# EAGLE design Nixie mainboard v1.0 (EAGLE 7.5.0)
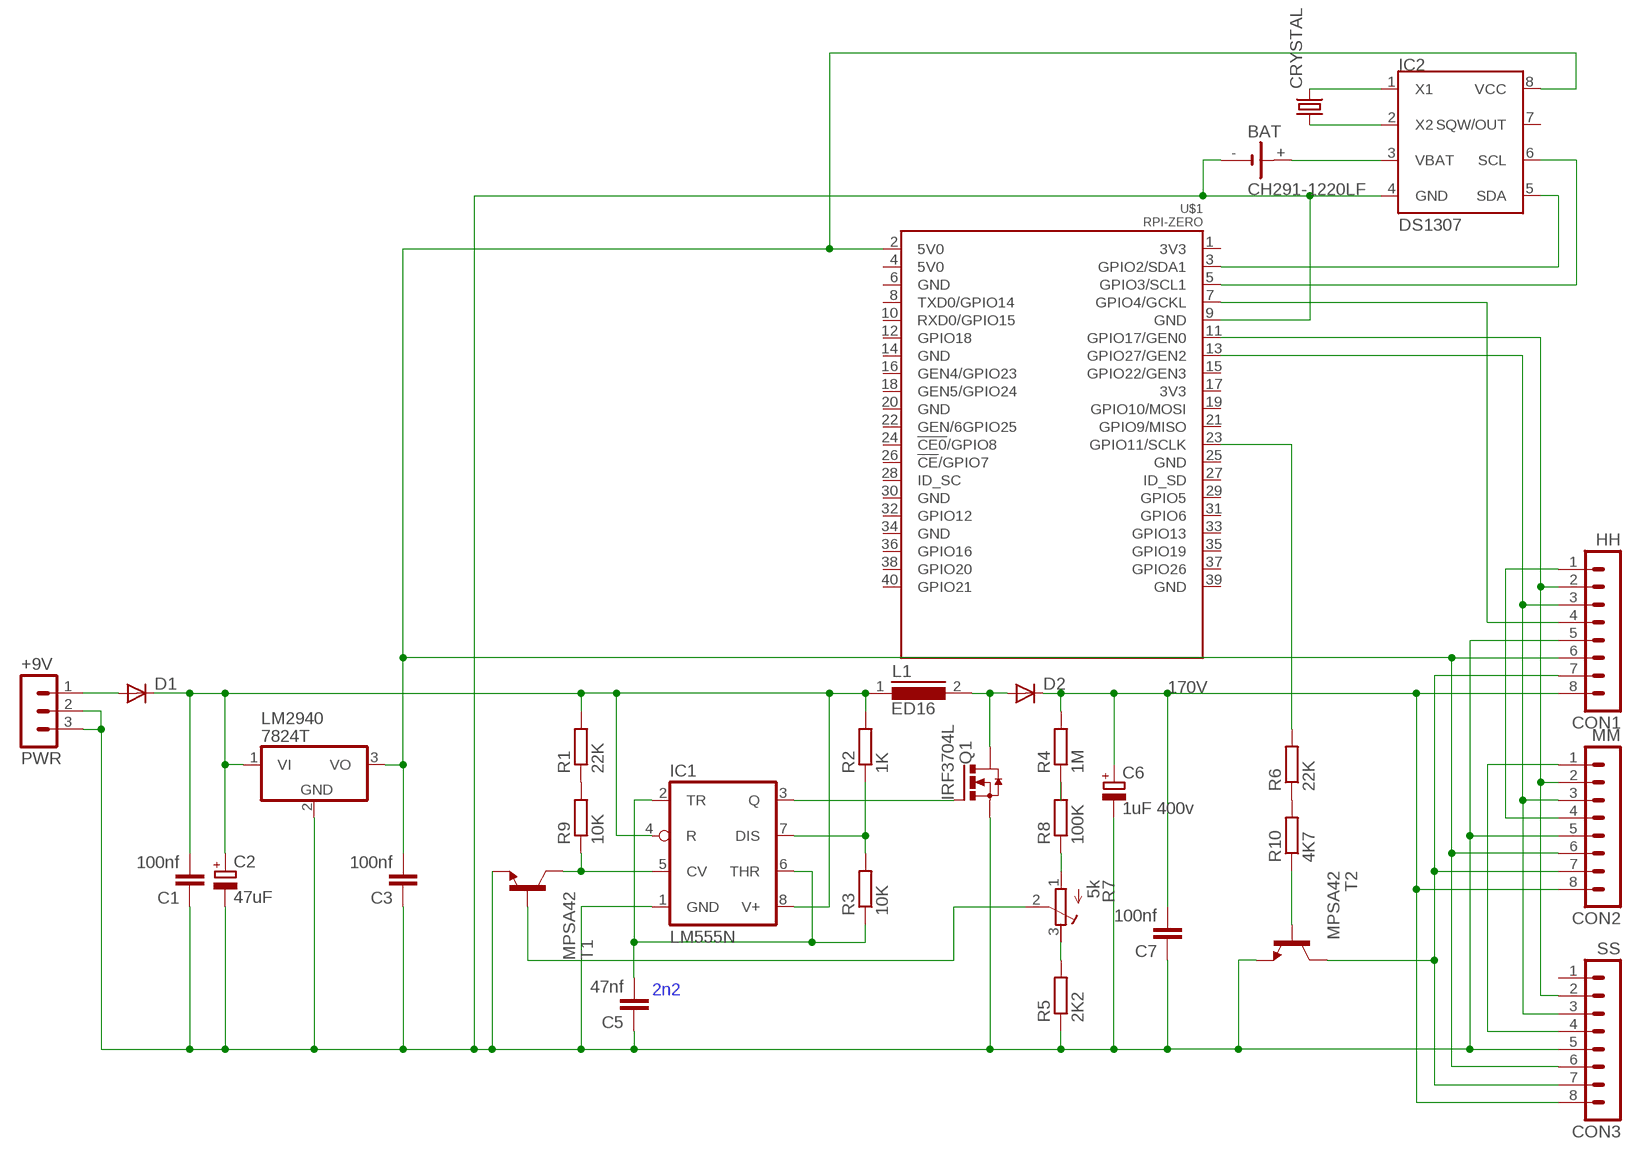
[diagram p0: schematic, sheet 1]

## Parts
BAT  CH291-1220LF  [CH291-1220LF]
C1  100nf  C-EU025-025X050  [C025-025X050]
C2  47uF  CPOL-EUE5-8.5  [E5-8,5]
C3  100nf  C-EU025-025X050  [C025-025X050]
C5  47nf  C-EU075-032X103  [C075-032X103]
C6  1uF 400v  CPOL-EUE2.5-6  [E2,5-6]
C7  100nf  C-EU075-032X103  [C075-032X103]
CON1  HH  MA08-1  [MA08-1]
CON2  MM  MA08-1  [MA08-1]
CON3  SS  MA08-1  [MA08-1]
CRYSTAL  CRYSTALTC26V  [TC26V]
D1  DIODE-DO41-10  [DO41-10]
D2  1N4936  1N4933  [DO41-10]
IC1  LM555N  [DIL08]
IC2  DS1307  [SOIC-8]
L1  ED16  [ED16]
LM2940  7824T  [TO220H]
PWR  +9V  MA03-1  [MA03-1]
Q1  IRF3704L  [TO262-H]
R1  22K  R-EU_0207/10  [0207/10]
R2  1K  R-EU_0207/10  [0207/10]
R3  10K  R-EU_0207/10  [0207/10]
R4  1M  R-EU_0207/10  [0207/10]
R5  2K2  R-EU_0207/10  [0207/10]
R6  22K  R-EU_0207/10  [0207/10]
R7  5k  R-TRIMM64W  [RTRIM64W]
R8  100K  R-EU_0207/10  [0207/10]
R9  10K  R-EU_0207/10  [0207/10]
R10  4K7  R-EU_0207/10  [0207/10]
T1  MPSA42  MPSA42-NPN-TO92-EBC  [TO92-EBC]
T2  MPSA42  MPSL51-NPN-TO92-CBE  [TO92-CBE]
U$1  RPI-ZERO  [RASPBERRYPI_BASTELSTUBE_V13_RASPI_BOARD_B+_FULL]

## Nets
5V0: C3.2 CON1.6 CON2.6 CON3.6 IC2.8(VCC) LM2940.3(VO) U$1.2(5V0)
170V: C6.+ C7.2 CON1.8 CON2.8 CON3.8 D2.C R4.2
CLK: CON1.2 CON2.2 CON3.2 U$1.11(GPIO17/GEN0)
DATA: CON1.4 U$1.7(GPIO4/GCKL)
GND@1: BAT.- C1.1 C2.- C3.1 C5.1 C6.- C7.1 CON1.5 CON2.5 CON3.5 IC1.1(GND) IC2.4(GND) LM2940.2(GND) PWR.2 PWR.3 Q1.3(S) R5.1 T1.E T2.E U$1.9(GND)
LATCH: CON1.3 CON2.3 CON3.3 U$1.13(GPIO27/GEN2)
LED: CON1.7 CON2.7 CON3.7 T2.C
LEDDRIVER: R6.2 U$1.23(GPIO11/SCLK)
N$1: CON1.1 CON2.4
N$2: CON2.1 CON3.4
N$4: BAT.+ IC2.3(VBAT)
N$6: R4.1 R8.2
N$7: R7.1(A) R8.1
N$8: R1.1 R9.2
N$9: R10.1 T2.B
N$11: IC2.6(SCL) U$1.5(GPIO3/SCL1)
N$12: IC2.5(SDA) U$1.3(GPIO2/SDA1)
N$13: R6.1 R10.2
N$14: CRYSTAL.1 IC2.2(X2)
N$15: CRYSTAL.2 IC2.1(X1)
N$95: D1.A PWR.1
N$99: IC1.3(Q) Q1.1(G)
N$100: IC1.7(DIS) R2.1 R3.2
N$101: IC1.5(CV) R9.1 T1.C
N$102: C5.2 IC1.2(TR) IC1.6(THR) R3.1
N$103: D2.A L1.2 Q1.2(D)
N$106: R7.2(S) T1.B
N$107: R5.2 R7.3(E)
V+: C1.2 C2.+ D1.C IC1.4(R) IC1.8(V+) L1.1 LM2940.1(VI) R1.2 R2.2
Unconnected: CON3.1 IC2.7(SQW/OUT) U$1.1(3V3) U$1.4(5V0) U$1.6(GND) U$1.8(TXD0/GPIO14) U$1.10(RXD0/GPIO15) U$1.12(GPIO18) U$1.14(GND) U$1.15(GPIO22/GEN3) U$1.16(GEN4/GPIO23) U$1.17(3V3) U$1.18(GEN5/GPIO24) U$1.19(GPIO10/MOSI) U$1.20(GND) U$1.21(GPIO9/MISO) U$1.22(GEN/6GPIO25) U$1.24(!CE0!/GPIO8) U$1.25(GND) U$1.26(!CE!/GPIO7) U$1.27(ID_SD) U$1.28(ID_SC) U$1.29(GPIO5) U$1.30(GND) U$1.31(GPIO6) U$1.32(GPIO12) U$1.33(GPIO13) U$1.34(GND) U$1.35(GPIO19) U$1.36(GPIO16) U$1.37(GPIO26) U$1.38(GPIO20) U$1.39(GND) U$1.40(GPIO21)

## Notes on the sheet
- 2n2

## Library data of the parts
BAT = battery:CH291-1220LF: Battery Holder, SMT, 12mm multicomp PART NO. CH291-1220LF Source: Data sheet <http://www.farnell.com/datasheets/1505860.pdf>
C1 C3 C5 C7 = rcl:C-EU: CAPACITOR, European symbol
C2 C6 = rcl:CPOL-EU: POLARIZED CAPACITOR, European symbol
CON1-CON3 = con-lstb:MA08-1: PIN HEADER; OC_FARNELL: unknown; OC_NEWARK: unknown
CRYSTAL = crystal:CRYSTAL: CRYSTAL; OC_FARNELL: unknown; OC_NEWARK: unknown
D1 = diode:DIODE-: DIODE
D2 = diode:1N4933: DIODE fast recovery rectifier, 1A
IC1 = linear:*555: TIMER
IC2 = dallas-1:DS1307: I2C Serial RTC w/56 bytes battery backed RAM
L1 = inductors:ED16: INDUCTOR
LM2940 = linear:78*: Positive VOLTAGE REGULATOR Source: http://cache.national.com/ds/LM/LM78L05.pdf http://www.fairchildsemi.com/ds/LM/LM7805.pdf
PWR = con-lstb:MA03-1: PIN HEADER; OC_FARNELL: unknown; OC_NEWARK: unknown
Q1 = transistor-power:IRF3704: SMPS MOSFET HEXFET® Power MOSFET Source: http://www.irf.com/product-info/datasheets/data/irf3704.pdf
R1-R6 R8-R10 = resistor:R-EU_: RESISTOR, European symbol
R7 = rcl:R-TRIMM: Trimm resistor
T1 T2 = transistor:*-NPN-: NPN Transistror BF959 corrected 2008.03.06
U$1 = RPI-Zero:RPI-ZERO

## Board
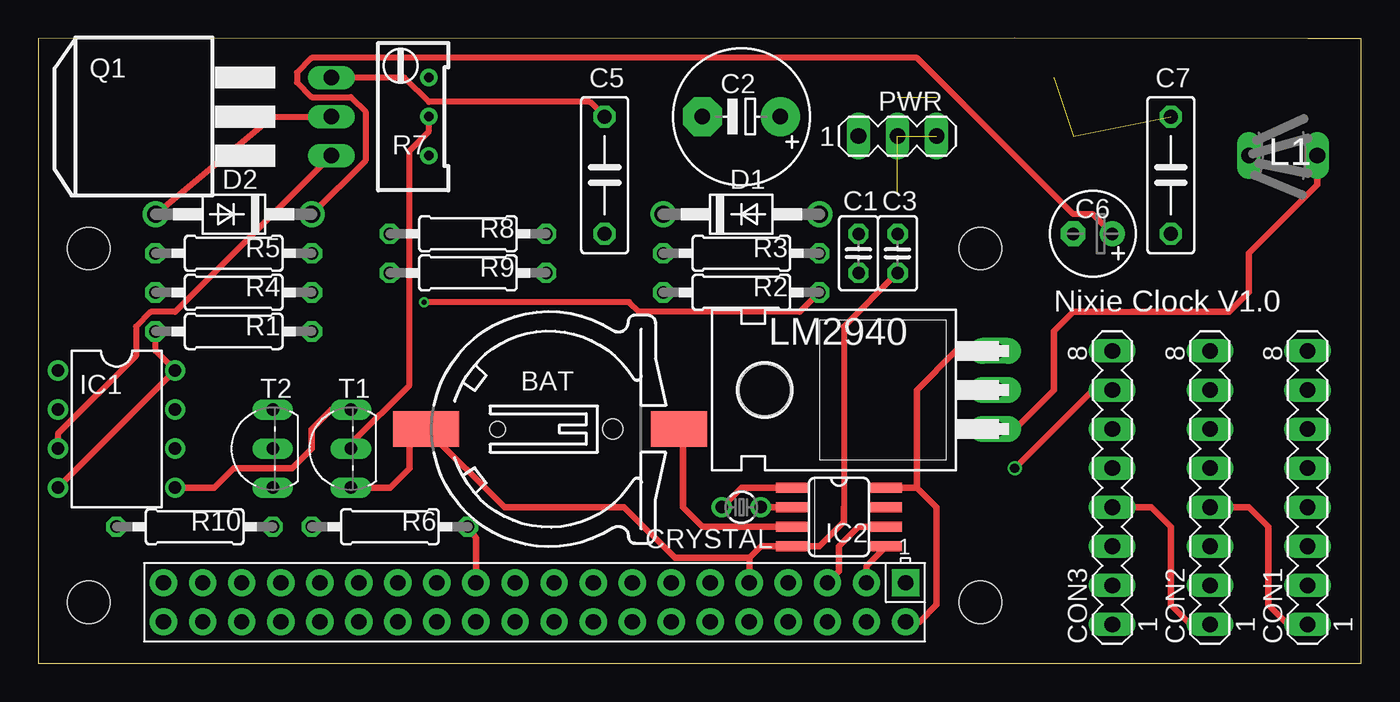
[diagram p1: board, top side]
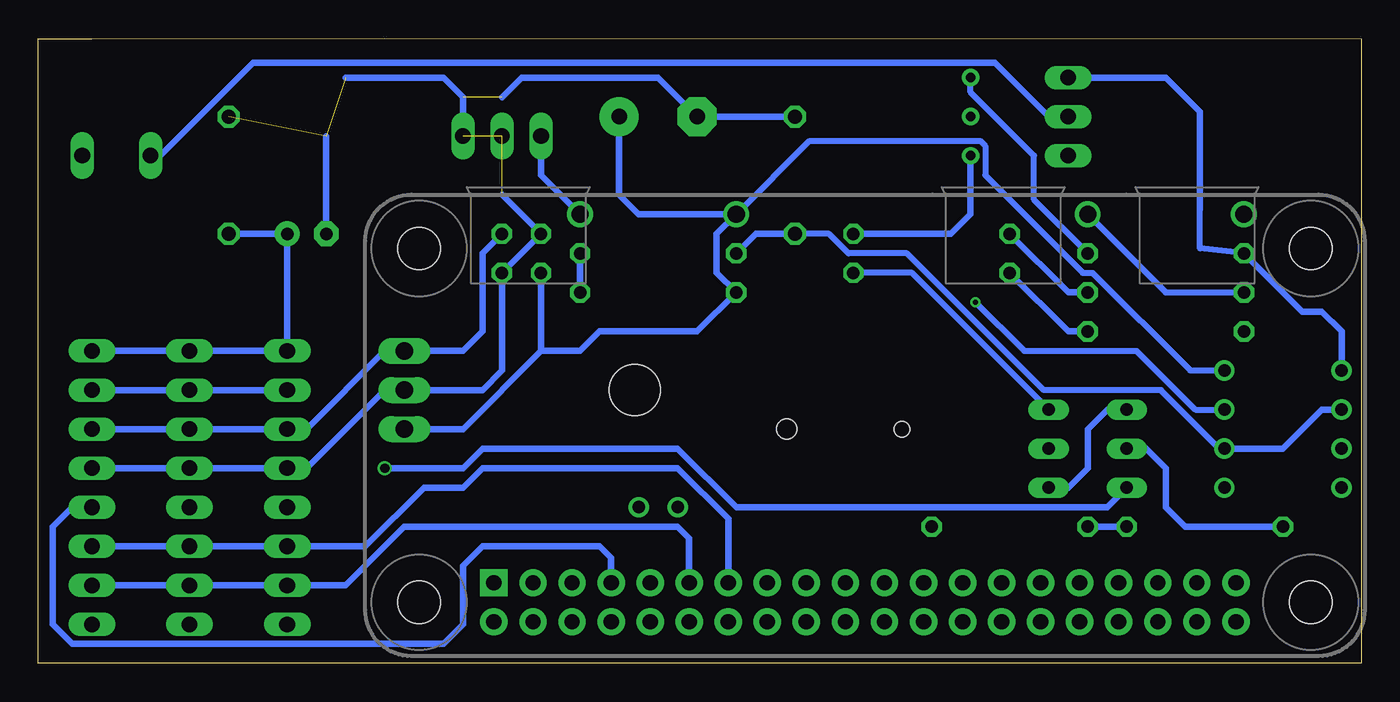
[diagram p2: board, bottom side, seen from below]

Size 86.03 x 40.64 mm. Coordinates in mm from the lower left corner, seen from the top.
Outline: 0,0 86.03,0 86.03,40.63 82.55,40.63 63.5,40.64 0,40.63 0,0
Copper layers (1*16): Top 0.035mm / dielectric 1.5mm / Bottom 0.035mm
Design rules "ShenZhen2U EagleRules": minimum track width 7mil, minimum drill 12mil, track to track 7mil, track to pad 7mil, pad to pad 7mil, via to via 7mil, smd to smd 0mil, copper to edge 20mil, drill to drill 10mil, minimum pad ring 10mil, minimum via ring 6mil, stop-mask expansion 2mil, vias tented up to drill 25mil, thermal gap 10mil

### Footprints (pad centres in the part's own frame; a part is rotated, then mirrored left to right if it is on the bottom)
CH291-1220LF = smd 2.3 x 3.66: + 0,-2.296 | smd 2.3 x 4.3: - 0,14.146 | hole 1.3: 0,2 | hole 1: 0,9.5
C025-025X050 = drill 0.813 octagon: 1 -1.27,0; 2 1.27,0
E5-8,5 = drill 1.016 pad 2.54: + -2.54,0 | drill 1.016 pad 2.54 octagon: - 2.54,0
C075-032X103 = drill 0.914 octagon: 1 -3.81,0; 2 3.81,0
E2,5-6 = drill 0.813 pad 1.6: + -1.27,0 | drill 0.813 pad 1.6 octagon: - 1.27,0
MA08-1 = drill 1.016 long: 1 -8.89,0; 2 -6.35,0; 3 -3.81,0; 4 -1.27,0; 5 1.27,0; 6 3.81,0; 7 6.35,0; 8 8.89,0
TC26V = drill 0.813: 1 -1.27,0; 2 1.27,0
DO41-10 = drill 1.118: A 5.08,0; C -5.08,0
DIL08 = drill 0.813 pad 1.27: 1 -3.81,-3.81; 2 -1.27,-3.81; 3 1.27,-3.81; 4 3.81,-3.81; 5 3.81,3.81; 6 1.27,3.81; 7 -1.27,3.81; 8 -3.81,3.81
SOIC-8 = smd 2.032 x 0.66: 1 -3.073,1.27; 2 -3.073,0; 3 -3.073,-1.27; 4 -3.073,-2.54; 5 3.073,-2.54; 6 3.073,-1.27; 7 3.073,0; 8 3.073,1.27
ED16 = drill 1.016 long: 1 -8.255,0; 2 -3.81,0
TO220H = drill 1.118 long: 1 -2.54,-10.16; 2 0,-10.16; 3 2.54,-10.16 | hole 3.302: 0,4.826
MA03-1 = drill 1.016 long: 1 -2.54,0; 2 0,0; 3 2.54,0
TO262-H = drill 1.016 long: 1 -2.54,-12.7; 2 0,-12.7; 3 2.54,-12.7
0207/10 = drill 0.813 octagon: 1 -5.08,0; 2 5.08,0
RTRIM64W = drill 0.61: 1 1.27,-2.54; 2 1.27,0; 3 1.27,2.54
TO92-EBC = drill 0.813 long: B 0,-1.27; C 2.54,-1.27; E -2.54,-1.27
TO92-CBE = drill 0.813 long: B 0,0; C -2.54,0; E 2.54,0
RASPBERRYPI_BASTELSTUBE_V13_RASPI_BOARD_B+_FULL = drill 1 pad 1.778 square: 1 8.37,25.23 | drill 1 pad 1.778: 2 8.37,27.77; 3 10.91,25.23; 4 10.91,27.77; 5 13.45,25.23; 6 13.45,27.77; 7 15.99,25.23; 8 15.99,27.77; 9 18.53,25.23; 10 18.53,27.77; 11 21.07,25.23; 12 21.07,27.77; 13 23.61,25.23; 14 23.61,27.77; 15 26.15,25.23; 16 26.15,27.77; 17 28.69,25.23; 18 28.69,27.77; 19 31.23,25.23; 20 31.23,27.77; 21 33.77,25.23; 22 33.77,27.77; 23 36.31,25.23; 24 36.31,27.77; 25 38.85,25.23; 26 38.85,27.77; 27 41.39,25.23; 28 41.39,27.77; 29 43.93,25.23; 30 43.93,27.77; 31 46.47,25.23; 32 46.47,27.77; 33 49.01,25.23; 34 49.01,27.77; 35 51.55,25.23; 36 51.55,27.77; 37 54.09,25.23; 38 54.09,27.77; 39 56.63,25.23; 40 56.63,27.77 | hole 2.75: 3.5,3.5; 3.5,26.5; 61.5,3.5; 61.5,26.5

### Placement (x,y rotation side)
BAT  39.37,15.24 90 top
C1  53.34,26.67 270 top
C2  45.72,35.56 180 top
C3  55.88,26.67 90 top
C5  36.83,31.75 270 top
C6  68.58,27.94 180 top
C7  73.66,31.75 270 top
CON1  82.55,11.43 90 top
CON2  76.2,11.43 90 top
CON3  69.85,11.43 90 top
CRYSTAL  45.72,10.16 180 top
D1  45.72,29.21 0 top
D2  12.7,29.21 180 top
IC1  5.08,15.24 270 top
IC2  52.07,10.16 0 top
L1  74.93,33.02 180 top
LM2940  52.07,17.78 90 top
PWR  55.88,34.29 0 top
Q1  6.35,35.56 90 top
R1  12.7,21.59 180 top
R2  45.72,24.13 180 top
R3  45.72,26.67 0 top
R4  12.7,24.13 180 top
R5  12.7,26.67 0 top
R6  22.86,8.89 0 top
R7  24.13,35.56 0 top
R8  27.94,27.94 180 top
R9  27.94,25.4 180 top
R10  10.16,8.89 0 top
T1  19.05,13.97 90 top
T2  15.24,13.97 90 top
U$1  64.77,30.48 180 top

### Tracks (layer width: path | path; a pad name or v marks a point on that pad's centre or on a via)
5V0
  Top 0.406: U$1.2 57.32,2.71 58.42,3.81 58.42,10.16 57.15,11.43 | 57.15,11.43 IC2.8 | 57.15,11.43 57.15,17.78 59.69,20.32 LM2940.3
  Bottom 0.406: CON1.6 CON2.6 CON3.6 68.58,15.24 63.5,20.32 LM2940.3 58.42,20.32 57.15,21.59 57.15,26.67 C3.2
170V
  Top 0.381: D2.C 21.27,32.7 21.27,35.88 20.32,36.83 17.78,36.83 16.83,37.78 16.83,38.42 17.78,39.37 57.15,39.37 67.31,29.21 68.58,29.21 C6.+
  Bottom 0.381: R4.2 12.7,24.13 D2.C
  Bottom 0.406: CON1.8 CON2.8 CON3.8 C6.+ C7.2
CLK
  Bottom 0.406: CON1.2 CON2.2 CON3.2 66.04,5.08 62.23,8.89 44.45,8.89 43.7,8.14 U$1.11
DATA
  Bottom 0.406: U$1.7 48.78,6.87 49.53,7.62 57.15,7.62 58.42,6.35 58.42,2.54 59.69,1.27 83.82,1.27 85.09,2.54 85.09,8.89 83.82,10.16 CON1.4
GND@1  (5 unrouted)
  Top 0.381: Q1.3 23.81,38.1 25.4,36.51 35.88,36.51 C5.1 | 49.85,7.62 IC2.4 | 52.39,10.16 52.39,21.91 C3.1
  Top 0.406: U$1.9 46.24,6.87 | 46.24,6.87 46.99,7.62 IC2.4 | BAT.- 30.3,10.16 38.1,10.16 41.39,6.87 46.24,6.87 | 49.85,7.62 50.8,7.62 52.39,9.21 52.39,10.16 | BAT.- 25.22,15.42 | T1.E 22.86,11.43 24.13,12.7 24.13,14.15 BAT.-
  Bottom 0.381: 10.48,29.53 10.48,26.99 R5.1
  Bottom 0.406: CON1.5 CON2.5 CON3.5 68.58,12.7 63.5,17.78 LM2940.2 57.15,17.78 55.88,19.05 C3.1 C1.1 55.88,30.48 | C6.- 67.31,34.29 | 66.04,38.1 59.69,38.1 58.42,36.83 PWR.3 | 10.48,29.53 10.48,35.88 12.7,38.1 Q1.3 | 55.88,36.83 54.61,38.1 45.72,38.1 C2.- C5.1 | T2.E 16.51,16.51 17.78,15.24 17.78,12.7 19.05,11.43 T1.E | IC1.1 1.27,21.59 2.54,22.86 3.81,22.86 R5.1
LATCH
  Bottom 0.406: CON1.3 CON2.3 CON3.3 64.77,7.62 60.96,11.43 58.42,11.43 57.15,12.7 44.45,12.7 41.16,9.41 U$1.13
LED  (via drill 0.6)
  Top 0.406: v63.5,12.7 68.58,17.78 CON3.7
  Bottom 0.406: CON3.7 CON2.7 CON1.7 | v63.5,12.7 58.42,12.7 57.15,13.97 44.45,13.97 40.64,10.16 16.51,10.16 T2.C
LEDDRIVER
  Top 0.406: U$1.23 28.46,8.14 R6.2
N$1
  Top 0.406: CON2.4 78.74,10.16 80.01,8.89 80.01,3.81 81.28,2.54 CON1.1
N$2
  Top 0.406: CON2.1 74.93,2.54 73.66,3.81 73.66,8.89 72.39,10.16 CON3.4
N$4
  Top 0.406: IC2.3 43.18,8.89 41.91,10.16 41.91,14.21 BAT.+
N$6
  Bottom 0.406: R4.1 19.05,24.13 R8.2
N$7
  Bottom 0.406: R7.1 25.4,29.21 26.67,27.94 R8.1
N$8
  Bottom 0.406: R1.1 19.05,21.59 R9.2
N$9
  Bottom 0.406: R10.1 11.43,8.89 12.7,10.16 12.7,12.7 13.97,13.97 T2.B
N$11
  Top 0.406: U$1.5 52.07,6 52.07,7.62 53.34,8.89 IC2.6
N$12
  Top 0.406: U$1.3 53.86,6.34 IC2.5
N$13
  Bottom 0.406: R10.2 R6.1
N$14
  Top 0.406: CRYSTAL.1 IC2.2
N$15
  Top 0.406: 49.53,11.43 IC2.1 45.72,11.43 CRYSTAL.2
N$95
  Bottom 0.406: D1.A 53.34,31.75 PWR.1
N$99
  Top 0.381: IC1.3 1.27,14.92 6.35,20 6.35,21.91 7.3,22.86 8.89,22.86 Q1.1
N$100  (via drill 0.33)
  Top 0.381: v25.08,23.5 38.42,23.5 39.05,22.86 49.53,22.86 R2.1
  Bottom 0.381: IC1.7 10.79,16.51 14.61,20.32 21.91,20.32 v25.08,23.5
  Bottom 0.406: R2.1 R3.2
N$101
  Top 0.406: IC1.5 11.43,11.43 12.7,12.7 16.51,12.7 17.78,13.97 17.78,15.24 19.05,16.51 T1.C
  Bottom 0.381: R9.1 29.21,25.4 T1.C
N$102
  Bottom 0.381: C5.2 34.61,27.94 33.34,26.67 29.53,26.67 20.64,17.78 13.02,17.78 9.21,13.97 IC1.6
  Bottom 0.406: C5.2 39.37,27.94 R3.1 | IC1.2 2.54,16.51 5.08,13.97 IC1.6
N$103
  Top 0.381: Q1.2 15.24,35.56 D2.A
  Bottom 0.381: L1.2 78.11,33.02 72.07,39.05
  Bottom 0.406: Q1.2 20.32,35.56 23.81,39.05 72.07,39.05
N$106
  Top 0.381: R7.2 25.4,34.61 24.13,33.34 24.13,18.1 20.32,14.29 T1.B
N$107
  Bottom 0.381: R7.3 25.4,37.15 21.27,33.02 21.27,30.16 R5.2
V+
  Top 0.381: 69.85,22.86 71.12,22.86 | LM2940.1 62.55,15.24 | R1.2 7.62,20.32 IC1.8 IC1.4
  Top 0.406: 62.55,15.24 63.5,15.24 66.04,17.78 66.04,21.59 67.31,22.86 69.85,22.86 | L1.1 83.19,31.11 78.74,26.67 78.74,24.13 77.47,22.86 71.12,22.86
  Bottom 0.381: IC1.8 11.11,19.05 17.46,25.4 18.1,25.4 24.45,31.75 24.45,33.65 24.77,33.97 35.88,33.97 D1.C
  Bottom 0.406: 53.34,20.32 58.42,15.24 LM2940.1 | C2.+ 48.26,30.48 46.99,29.21 D1.C 41.91,27.94 41.91,25.4 R2.2 43.18,21.59 49.53,21.59 50.8,20.32 53.34,20.32 | C1.2 53.34,20.32

### Text on the board
_tsilk: Nixie Clock V1.0